# EAGLE design asynclabs_wishield_v1 (EAGLE 5.04)
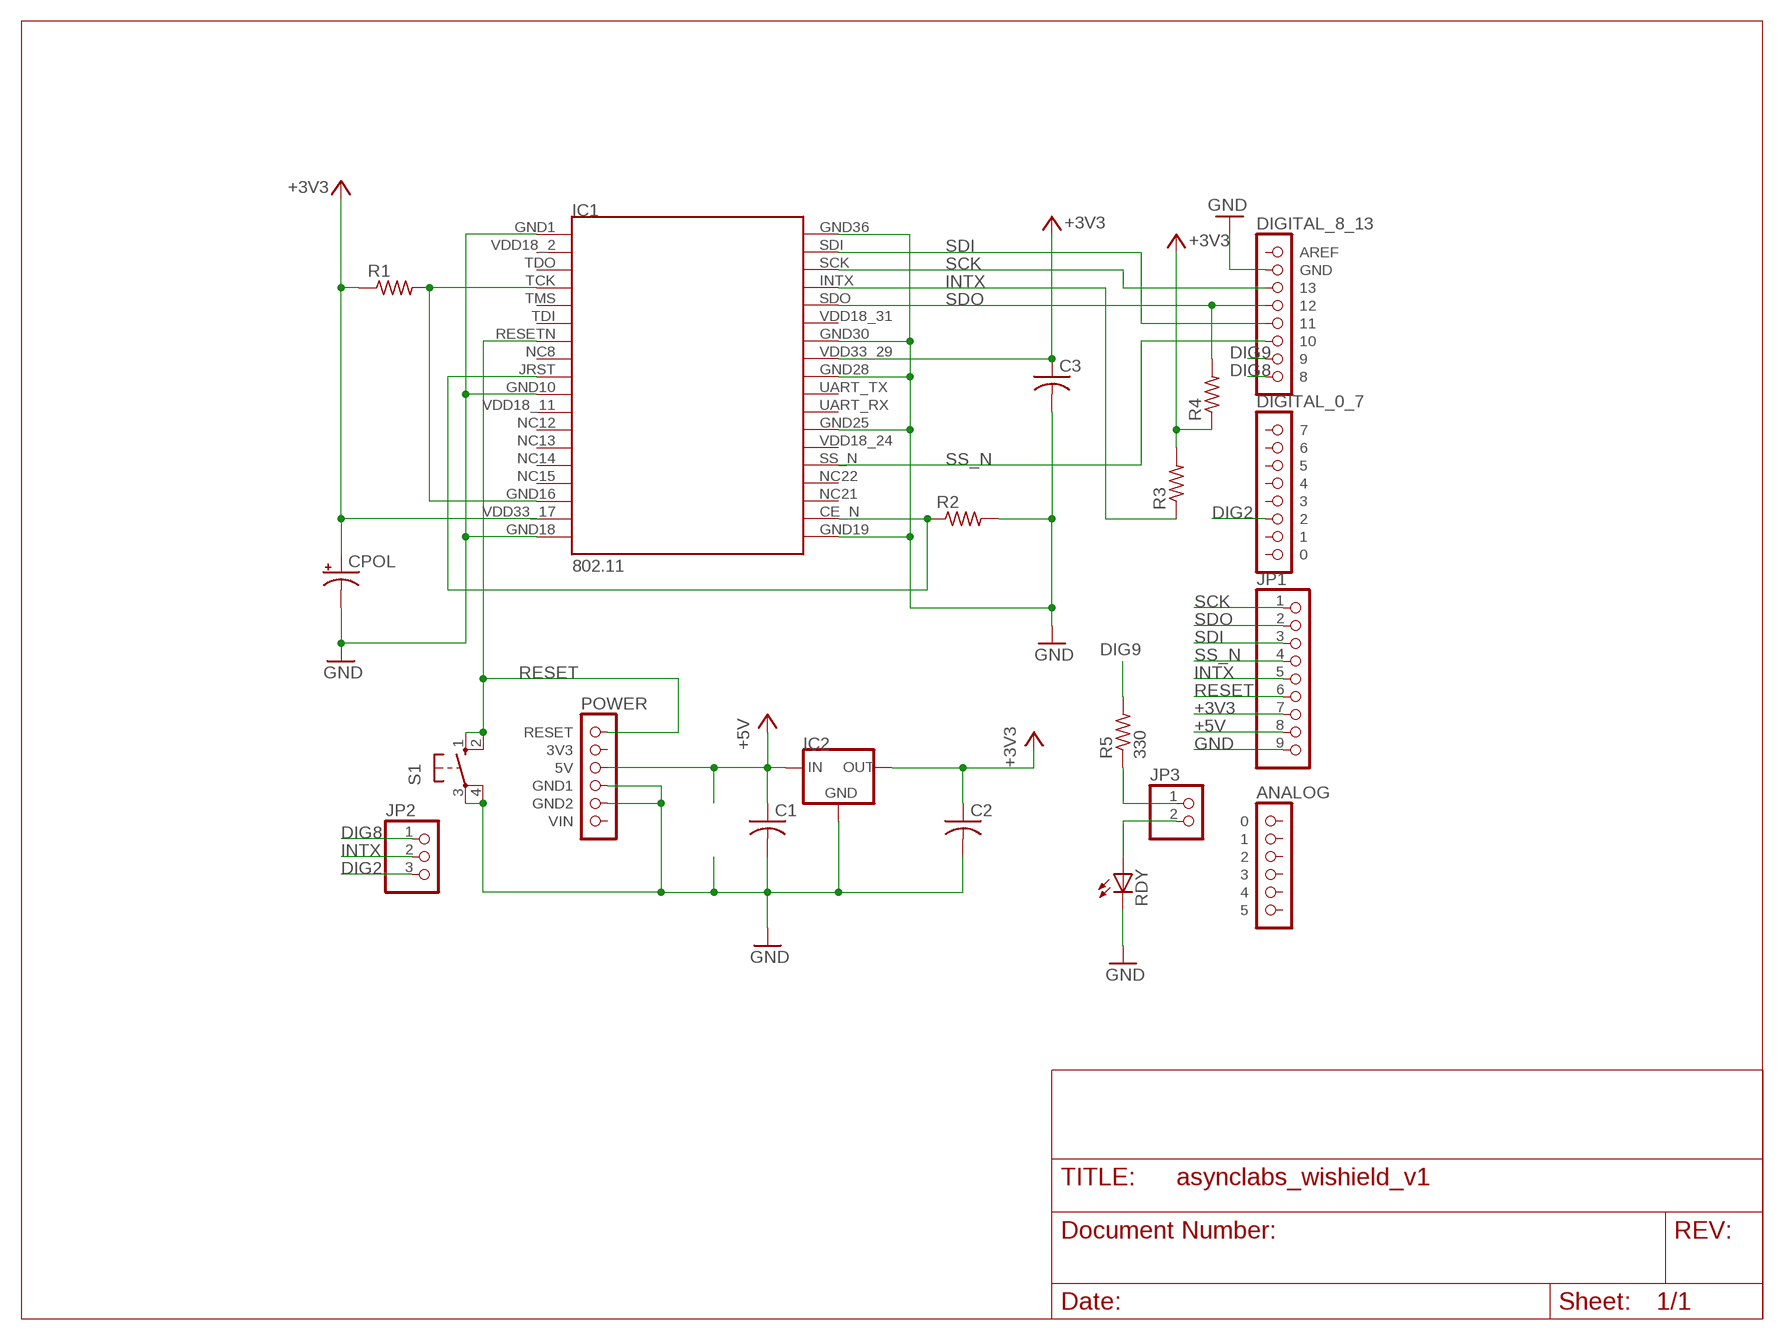
[diagram p0: schematic, sheet 1]

## Parts
C1  CAP  [CAP]
C2  CAP  [CAP]
C3  CAP  [CAP]
CPOL  PCAP  [PCAP]
IC1  802.11  ZG2100MOD  [ZG2100MOD]
IC2  MCP1700  [MCP1700]
JP1  PINHD9  [PINHD9]
JP2  PINHD3  [PINHD3]
JP3  PINHD2  [PINHD2]
R1  RES_SMALL  [RES_SMALL]
R2  RES_SMALL  [RES_SMALL]
R3  RES_SMALL  [RES_SMALL]
R4  RES  [RES]
R5  330  RES_SMALL  [RES_SMALL]
RDY  LED3MM  [LED3MM]
S1  SWITCH  [SWITCH]
U$1  POWER  [1X06]
U$2  ANALOG  [1X06]
U$3  DIGITAL_0_7  [1X08]
U$4  DIGITAL_8_13  [1X08]

## Nets
+3V3: C2.1 C3.1 CPOL.+ IC1.VDD33_17 IC1.VDD33_29 IC2.VOUT JP1.7 R1.1 R3.2 R4.1
+5V: C1.1 IC2.VIN JP1.8 U$1.3(5V)
DIG2: JP2.3 U$3.6
DIG8: JP2.1 U$4.8
DIG9: R5.2 U$4.7
GND: C1.2 C2.2 C3.2 CPOL.- IC1.GND1 IC1.GND10 IC1.GND18 IC1.GND19 IC1.GND25 IC1.GND28 IC1.GND30 IC1.GND36 IC2.GND JP1.9 R2.2 RDY.K(C) S1.3(P) S1.4(P1) U$1.4(GND1) U$1.5(GND2) U$4.2(GND)
GND_TIE: IC1.CE_N IC1.JRST R2.1
INTX: IC1.INTX JP1.5 JP2.2 R3.1
N$1: JP3.1 R5.1
N$2: JP3.2 RDY.A
RESET: IC1.RESETN(RSTN) JP1.6 S1.1(S) S1.2(S1) U$1.1(RESET)
SCK: IC1.SCK JP1.1 U$4.3
SDI: IC1.SDI JP1.3 U$4.5
SDO: IC1.SDO JP1.2 R4.2 U$4.4
SS_N: IC1.SS_N JP1.4 U$4.6
VDD_TIE: IC1.GND16 IC1.TCK R1.2
Unconnected: IC1.NC8 IC1.NC12 IC1.NC13 IC1.NC14 IC1.NC15 IC1.NC21 IC1.NC22 IC1.TDI IC1.TDO IC1.TMS IC1.UART_RX IC1.UART_TX IC1.VDD18_2 IC1.VDD18_11 IC1.VDD18_24 IC1.VDD18_31 U$1.2(3V3) U$1.6(VIN) U$2.1 U$2.2 U$2.3 U$2.4 U$2.5 U$2.6 U$3.1 U$3.2 U$3.3 U$3.4 U$3.5 U$3.7 U$3.8 U$4.1(AREF)

## Library data of the parts
C1-C3 = ZGLIB:CAP
CPOL = ZGLIB:PCAP
IC1 = ZGLIB:ZG2100MOD: ZG2100 Module
IC2 = ZGLIB:MCP1700
JP1 = ZGLIB:PINHD9
JP2 = ZGLIB:PINHD3
JP3 = ZGLIB:PINHD2
R1-R3 R5 = ZGLIB:RES_SMALL
R4 = ZGLIB:RES
RDY = led:LED: LED OSRAM: - CHIPLED LG R971, LG N971, LY N971, LG Q971, LY Q971, LO R971, LY R971 LH N974, LH R974 LS Q976, LO Q976, LY Q976 LO Q996 - Hyper CHIPLED LW Q18S LB Q993, LB Q99A, LB R99A - SideLED LS A670, LO A670, LY A670, LG A670, LP A670 LB A673, LV A673, LT A673, LW A673 LH A674 LY A675 LS A676, LA A676, LO A676, LY A676, LW A676 LS A679, LY A679, LG A679 - Hyper Micro SIDELED® LS Y876, LA Y876, LO Y876, LY Y876 LT Y87S - SmartLED LW L88C, LW L88S LB L89C, LB L89S, LG L890 LS L89K, LO L89K, LY L89K LS L896, LA L896, LO L896, LY L896 - TOPLED LS T670, LO T670, LY T670, LG T670, LP T670 LSG T670, LSP T670, LSY T670, LOP T670, LYG T670 LG T671, LOG T671, LSG T671 LB T673, LV T673, LT T673, LW T673 LH T674 LS T676, LA T676, LO T676, LY T676, LB T676, LH T676, LSB T676, LW T676 LB T67C, LV T67C, LT T67C, LS T67K, LO T67K, LY T67K, LW E67C LS E67B, LA E67B, LO E67B, LY E67B, LB E67C, LV E67C, LT E67C LW T67C LS T679, LY T679, LG T679 LS T770, LO T770, LY T770, LG T770, LP T770 LB T773, LV T773, LT T773, LW T773 LH T774 LS E675, LA E675, LY E675, LS T675 LS T776, LA T776, LO T776, LY T776, LB T776 LHGB T686 LT T68C, LB T68C - Hyper Mini TOPLED® LB M676 - Mini TOPLED Santana® LG M470 LS M47K, LO M47K, LY M47K Source: http://www.osram.convergy.de LUXEON: - LUMILED® LXK2-PW12-R00, LXK2-PW12-S00, LXK2-PW14-U00, LXK2-PW14-V00 LXK2-PM12-R00, LXK2-PM12-S00, LXK2-PM14-U00 LXK2-PE12-Q00, LXK2-PE12-R00, LXK2-PE12-S00, LXK2-PE14-T00, LXK2-PE14-U00 LXK2-PB12-K00, LXK2-PB12-L00, LXK2-PB12-M00, LXK2-PB14-N00, LXK2-PB14-P00, LXK2-PB14-Q00 LXK2-PR12-L00, LXK2-PR12-M00, LXK2-PR14-Q00, LXK2-PR14-R00 LXK2-PD12-Q00, LXK2-PD12-R00, LXK2-PD12-S00 LXK2-PH12-R00, LXK2-PH12-S00 LXK2-PL12-P00, LXK2-PL12-Q00, LXK2-PL12-R00 Source: www.luxeon.com KINGBRIGHT: KA-3528ASYC Source: www.kingbright.com
S1 = ZGLIB:SWITCH
U$1 = arduino:POWER
U$2 = arduino:ANALOG
U$3 = arduino:DIGITAL_0_7
U$4 = arduino:DIGITAL_8_13

## Board
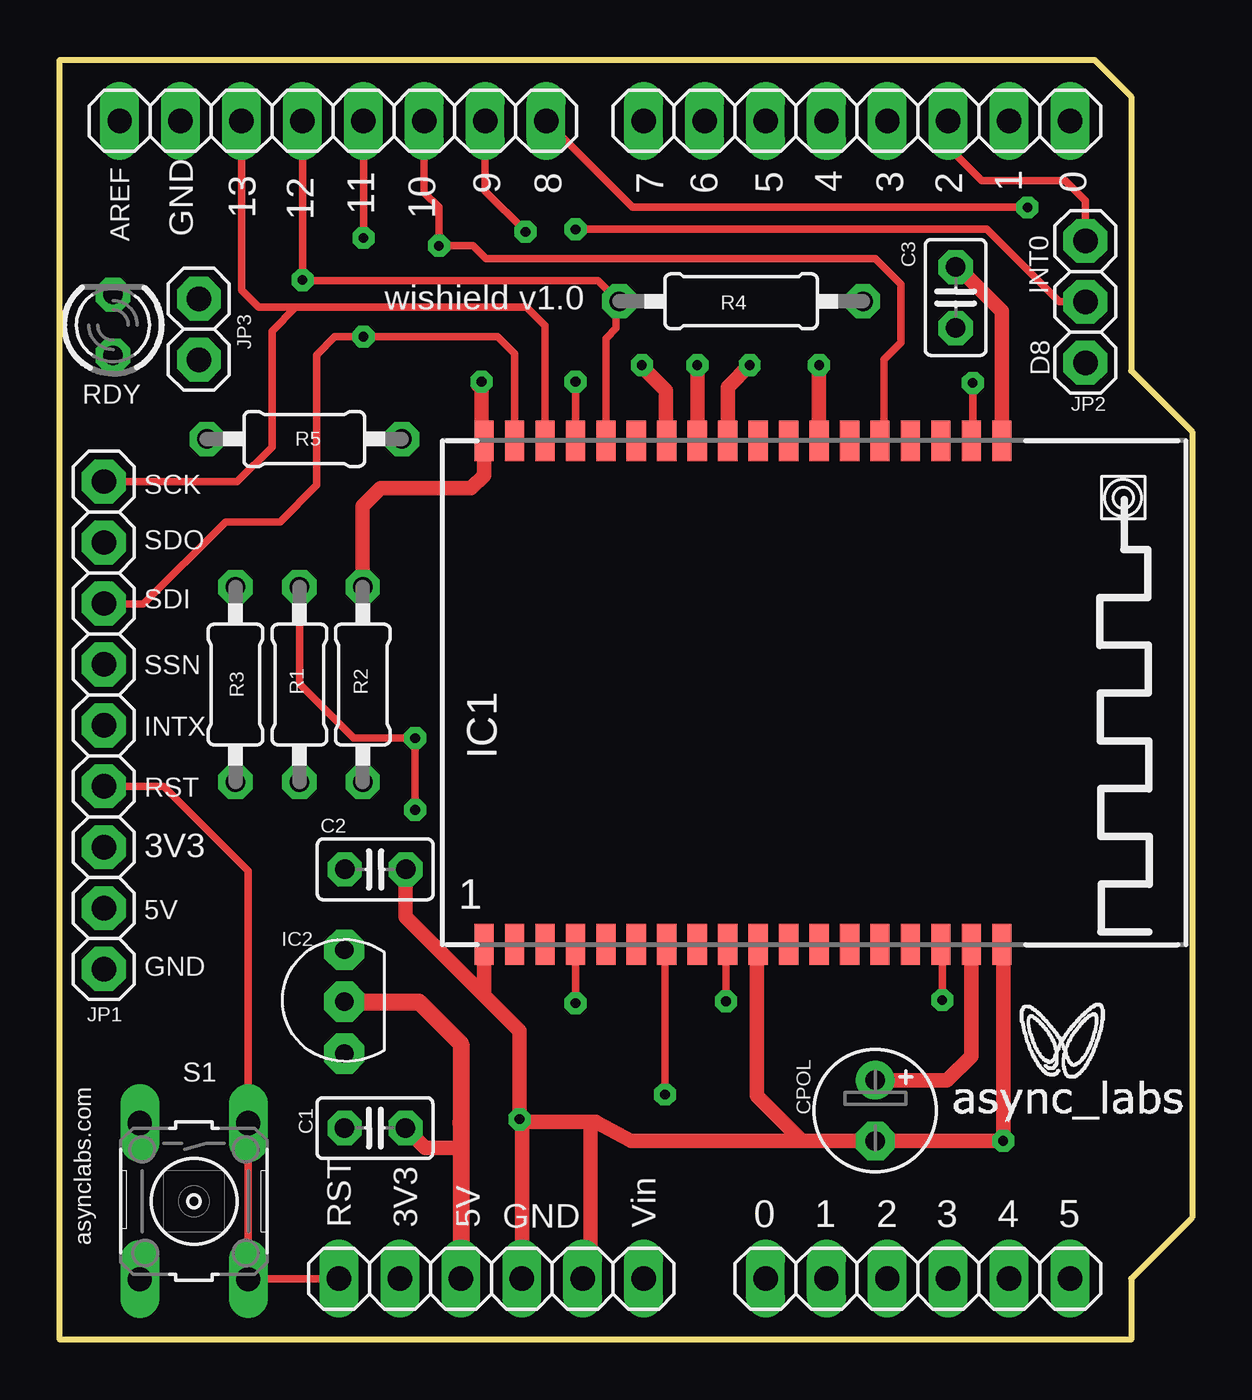
[diagram p1: board, top side]
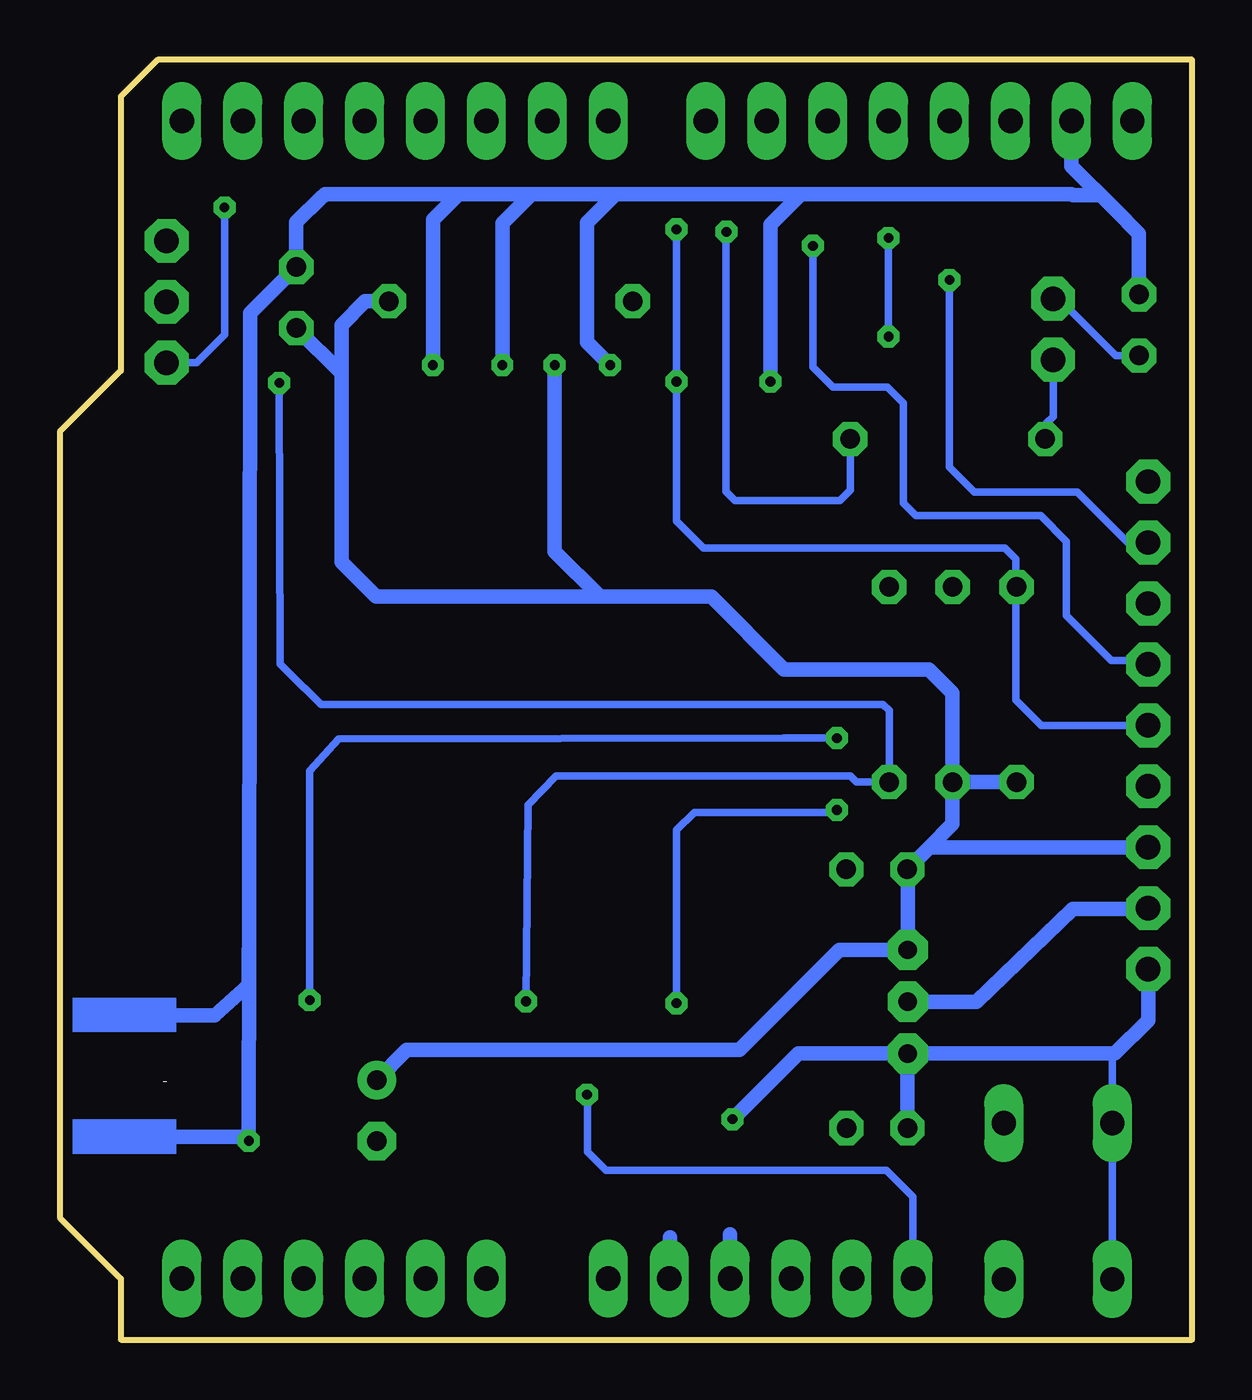
[diagram p2: board, bottom side, seen from below]

Size 47.19 x 53.34 mm. Coordinates in mm from the lower left corner, seen from the top.
Outline: 0,53.34 43.13,53.34 44.65,51.82 44.65,40.39 47.19,37.85 47.19,5.08 44.65,2.54 44.65,0 0,0 0,53.34
Copper layers (1*16): Top 0.035mm / dielectric 1.5mm / Bottom 0.035mm
Design rules "SparkFun_DRC *": minimum track width 8mil, minimum drill 16mil, track to track 8mil, track to pad 8mil, pad to pad 8mil, via to via 8mil, smd to smd 8mil, copper to edge 10mil, drill to drill 8mil, minimum pad ring 12mil, minimum via ring 10mil, stop-mask expansion 4mil, vias tented up to drill 25mil, thermal gap 10mil

### Footprints (pad centres in the part's own frame; a part is rotated, then mirrored left to right if it is on the bottom)
CAP = drill 0.813 octagon: 1 -1.27,0; 2 1.27,0
PCAP = drill 0.813 pad 1.6 round: + -1.27,0 | drill 0.813 pad 1.6 octagon: - 1.27,0
ZG2100MOD = smd 0.8 x 1.7: CE_N 6.63,10.12; GND1 -13.69,-10.88; GND10 -2.26,-10.88; GND16 5.36,-10.88; GND18 7.9,-10.88; GND19 7.9,10.12; GND25 0.28,10.12; GND28 -3.53,10.12; GND30 -6.07,10.12; GND36 -13.69,10.12; INTX -9.88,10.12; JRST -3.53,-10.88; NC8 -4.8,-10.88; NC12 0.28,-10.88; NC13 1.55,-10.88; NC14 2.82,-10.88; NC15 4.09,-10.88; NC21 5.36,10.12; NC22 4.09,10.12; RESETN -6.07,-10.88; SCK -11.15,10.12; SDI -12.42,10.12; SDO -8.61,10.12; SS_N 2.82,10.12; TCK -9.88,-10.88; TDI -7.34,-10.88; TDO -11.15,-10.88; TMS -8.61,-10.88; UART_RX -0.99,10.12; UART_TX -2.26,10.12; VDD18_2 -12.42,-10.88; VDD18_11 -0.99,-10.88; VDD18_24 1.55,10.12; VDD18_31 -7.34,10.12; VDD33_17 6.63,-10.88; VDD33_29 -4.8,10.12
MCP1700 = drill 0.762 pad 1.676 octagon: GND -2.159,0; VIN 0,0; VOUT 2.159,0
PINHD9 = drill 1.016 pad 1.829 octagon: 1 -10.16,0; 2 -7.62,0; 3 -5.08,0; 4 -2.54,0; 5 0,0; 6 2.54,0; 7 5.08,0; 8 7.62,0; 9 10.16,0
PINHD3 = drill 1.016 pad 1.829 octagon: 1 -2.54,0; 2 0,0; 3 2.54,0
PINHD2 = drill 1.016 pad 1.829 octagon: 1 -1.27,0; 2 1.27,0
RES_SMALL = drill 0.813 octagon: 1 -4.064,0; 2 4.064,0
RES = drill 0.813 octagon: 1 -5.08,0; 2 5.08,0
LED3MM = drill 0.813 octagon: A -1.27,0; K 1.27,0
SWITCH = drill 1.016 long: 1 -3.251,2.261; 2 3.251,2.261; 3 -3.251,-2.261; 4 3.251,-2.261
1X06 = drill 1.016 long: 1 -6.35,0; 2 -3.81,0; 3 -1.27,0; 4 1.27,0; 5 3.81,0; 6 6.35,0
1X08 = drill 1.016 long: 1 -8.89,0; 2 -6.35,0; 3 -3.81,0; 4 -1.27,0; 5 1.27,0; 6 3.81,0; 7 6.35,0; 8 8.89,0

### Placement (x,y rotation side)
C1  13.13,8.81 180 top
C2  13.14,19.6 0 top
C3  37.34,43.44 90 top
CPOL  33.99,9.54 270 top
IC1  31.37,27.35 0 top
IC2  11.85,14.08 90 top
JP1  1.83,25.6 270 top
JP2  42.75,43.26 90 top
JP3  5.79,42.11 90 top
R1  9.98,27.3 90 top
R2  12.62,27.3 90 top
R3  7.32,27.3 270 top
R4  28.4,43.28 180 top
R5  10.19,37.54 0 top
RDY  2.21,42.29 90 top
S1  5.58,5.76 270 top
U$1  17.98,2.54 0 top
U$2  35.76,2.54 0 top
U$3  33.22,50.8 0 top
U$4  11.38,50.8 0 top

### Tracks (layer width: path | path; a pad name or v marks a point on that pad's centre or on a via)
+3V3  (via drill 0.41)
  Top 0.406: IC1.VDD33_17
  Top 0.61: IC1.VDD33_29 v26.57,40.61 | IC1.VDD33_17 38,11.81 36.98,10.8 34.01,10.8 CPOL.+
  Bottom 0.305: 35.46,39.7 35.46,40.29
  Bottom 0.61: IC2.VOUT 11.85,19.58 C2.1 10.95,20.52 | IC2.VOUT | IC2.VOUT 14.7,16.24 18.87,12.07 32.74,12.07 CPOL.+ | 24.69,30.96 34.01,30.96 35.46,32.41 35.46,39.7 35.46,42.29 34.47,43.28 R4.1 | v26.57,40.61 26.57,32.84 24.69,30.96 | 35.46,40.29 C3.1 | 24.69,30.96 20.04,30.96 17.02,27.94 10.97,27.94 9.98,26.95 R1.1 | JP1.7 10.95,20.52 | 10.95,20.52 9.98,21.49 R1.1 | R1.1 R3.2
+5V
  Top 0.61: IC2.VIN | C1.1 15.21,8 16.71,8
  Top 0.711: IC2.VIN 14.96,14.07 16.71,12.32 16.71,9.02 | 16.71,9.02 16.71,8 U$1.3 | 16.71,9.02 16.71,9.07
  Bottom 0.203: JP1.8 1.85,17.96
  Bottom 0.61: IC2.VIN 11.84,14.07 8.99,14.07 4.98,17.96 1.85,17.96
DIG2
  Top 0.305: U$3.6 37.03,49.71 38.43,48.31 41.91,48.31 42.75,47.47 JP2.3
DIG8  (via drill 0.41)
  Top 0.305: v40.34,47.19 23.88,47.19 U$4.8
  Bottom 0.305: v40.34,47.19 40.34,41.88 41.5,40.72 JP2.1
DIG9  (via drill 0.41)
  Top 0.305: v19.41,46.18 19.41,46.2 17.73,47.88 U$4.7
  Bottom 0.305: R5.2 14.25,35.41 14.68,34.98 19.05,34.98 19.43,35.36 19.43,46.15 v19.41,46.18
GND  (via drill 0.41)
  Top 0.406: 39.32,16.47 IC1.GND18 | 29.06,16.42 IC1.GND10
  Top 0.61: IC1.GND25 31.65,38 v31.65,40.61 | 32.04,8.28 CPOL.- | 39.32,16.47 v39.32,8.28 32.04,8.28 | 29.06,16.42 29.06,10.16 30.94,8.28 31.42,8.28 | IC1.GND1 17.68,14.35 17.78,14.25 | C2.2 14.41,17.62 17.78,14.25 | 19.25,9.07 U$1.4 | 31.42,8.28 23.8,8.28 22.36,9.06 22.35,9.07 22.12,9.07 | 31.42,8.28 32.04,8.28 | 19.25,9.07 22.12,9.07 | 19.25,9.07 19.25,9.09 v19.16,9.19 19.16,12.87 17.78,14.25 | IC1.GND19 39.27,42.88 37.44,44.71 C3.2 | IC1.GND30 25.27,37.49 25.27,39.55 24.26,40.56 v24.26,40.61 | IC1.GND28 27.84,39.7 v28.75,40.61 | 17.42,39.78 v17.58,39.93 17.58,37.47 IC1.GND36 17.68,36.02 17.15,35.48 13.36,35.48 12.62,34.75 R2.2 | U$1.5 22.12,2.54 22.12,9.07
  Bottom 0.254: 39.32,16.41 39.32,16.61 39.31,16.64
  Bottom 0.305: S1.4 S1.3 3.32,11.81 3.22,11.92
  Bottom 0.406: 39.32,16.41 39.32,16.26
  Bottom 0.61: v17.58,39.93 17.58,46.48 16.31,47.75 | 16.31,47.75 5.03,47.75 4.98,47.7 3.81,47.7 3.23,47.12 | 24.03,47.75 16.31,47.75 | v31.65,40.61 31.65,46.69 30.58,47.75 29.82,47.75 | 29.82,47.75 27.53,47.75 | 27.53,47.75 24.03,47.75 | 44.73,13.51 40.74,13.51 39.32,14.78 39.32,16.26 | 39.27,42.72 39.31,16.64 v39.32,8.28 39.32,8.45 44.6,8.45 | v19.16,9.19 16.41,11.94 11.87,11.94 IC2.GND | IC2.GND 3.22,11.92 1.83,13.31 JP1.9 | 39.27,42.72 39.27,42.73 | IC2.GND C1.2 | 39.27,42.72 39.27,42.78 C3.2 37.34,46.58 36.27,47.65 36.25,47.65 36.14,47.75 29.82,47.75 | v24.26,40.61 25.22,41.58 25.22,46.56 24.03,47.75 | v28.75,40.61 28.75,46.53 27.53,47.75 | RDY.K 2.21,46.1 3.23,47.12 | U$4.2 5.03,48.92 3.23,47.12 | U$1.4 19.25,4.39 | U$1.5 21.77,2.54 21.77,4.27
GND_TIE  (via drill 0.41)
  Top 0.305: IC1.CE_N 38.05,37.8 v38.05,39.88 | IC1.JRST 27.76,16.47 v27.76,14.1
  Bottom 0.305: v27.76,14.1 27.69,22.28 26.52,23.5 14.25,23.5 14,23.24 R2.1 12.62,26.21 12.88,26.47 36.3,26.47 36.99,27.16 37.01,27.16 38.02,28.17 v38.05,39.88
INTX  (via drill 0.41)
  Top 0.305: v21.49,39.93 21.49,37.52 | v21.49,46.28 38.63,46.28 41.66,43.26 JP2.2
  Top 0.61: 21.49,37.52 IC1.INTX
  Bottom 0.203: 7.34,31.37 R3.1
  Bottom 0.305: v21.49,46.28 v21.49,39.93 21.49,34.11 20.37,32.99 7.8,32.99 7.34,32.54 7.34,31.37 7.34,26.67 6.27,25.6 JP1.5
N$1
  Bottom 0.305: JP3.1 5.79,38.48 6.07,38.2 6.07,37.59 R5.1
N$2
  Bottom 0.305: RDY.A 3.18,41.02 5.23,43.08 5.49,43.08 JP3.2
RESET  (via drill 0.41)
  Top 0.305: IC1.RESETN 25.22,16.39 v25.22,10.21 | U$1.1 7.87,2.54 S1.2 S1.1 7.85,19.54 4.32,23.06 JP1.6
  Bottom 0.305: v25.22,10.21 25.2,10.19 25.2,7.82 24.44,7.06 12.75,7.06 11.63,5.94 U$1.1
SCK
  Top 0.305: IC1.SCK 20.22,42.27 19.46,43.03 9.83,43.03 | 9.83,43.03 8.28,43.03 7.57,43.74 U$4.3 | JP1.1 7.39,35.76 8.84,37.21 8.84,42.04 9.83,43.03
SDI  (via drill 0.41)
  Top 0.305: IC1.SDI 18.95,41.1 18.24,41.81 v12.65,41.81 11.46,41.81 10.69,41.05 10.69,35.61 9.17,34.09 6.91,34.09 3.48,30.66 1.85,30.66 JP1.3 | v12.65,45.92 U$4.5
  Bottom 0.305: v12.65,41.81 v12.65,45.92
SDO  (via drill 0.41)
  Top 0.305: 10.11,44.2 10.11,44.22 | 10.11,44.2 U$4.4 | 10.69,44.15 10.19,44.15 v10.11,44.17 10.69,44.15 | 10.69,44.15 10.11,44.2 | IC1.SDO 22.76,41.73 23.19,42.16 23.19,43.15 R4.2 23.29,43.28 22.43,44.15 10.69,44.15
  Bottom 0.305: JP1.2 2.67,33.22 4.78,35.33 9.07,35.33 10.11,36.37 v10.11,44.17
SS_N  (via drill 0.41)
  Top 0.305: IC1.SS_N | 33.07,45.06 33.68,45.06 | U$4.6 15.19,47.8 15.8,47.19 v15.8,45.59 17.22,45.59 17.75,45.06 33.07,45.06 | 34.34,37.62 34.34,40.84 35.05,41.55 35.05,43.99 33.99,45.06 33.07,45.06
  Top 0.406: 34.34,37.62 IC1.SS_N
  Bottom 0.305: v15.8,45.59 15.8,40.54 14.96,39.7 12.7,39.7 12.04,39.04 12.04,34.87 11.51,34.34 7.82,34.34 | 7.82,34.34 6.3,34.34 5.23,33.27 5.23,30.18 3.37,28.31 1.99,28.31 JP1.4 | 7.82,34.34 8.66,34.34
VDD_TIE  (via drill 0.41)
  Top 0.305: v14.81,25.07 14.81,25.04 | IC1.TCK 21.49,14.71 v21.49,14.02 | v14.81,22.07 v14.81,25.07 | v36.78,14.15 36.78,16.41 | v14.81,25.07 12.24,25.07 9.98,27.33 R1.2
  Top 0.61: 36.78,16.41 IC1.GND16
  Bottom 0.305: v14.81,22.07 15.14,21.97 20.75,21.97 21.49,21.23 v21.49,14.02 | v14.81,25.07 17.04,25.07 35.59,25.04 36.78,23.7 v36.78,14.15
(copper drawn outside any net)
  shapes: Bottom area x2

### Text on the board
tNames: 9 | 8 | 7 | 6 | 5 | 4 | 3 | 2 | 1 | 0 | 13 | 12 | 11 | 10 | AREF | GND | wishield v1.0 | INT0 | D8 | SCK | SDO | SDI | SSN | INTX | RST | 3V3 | 5V | GND | asynclabs.com | GND | RST | 3V3 | 5V | Vin | 0 | 1 | 2 | 3 | 4 | 5